# EAGLE design 2-psg-plain (EAGLE 6.6.0)
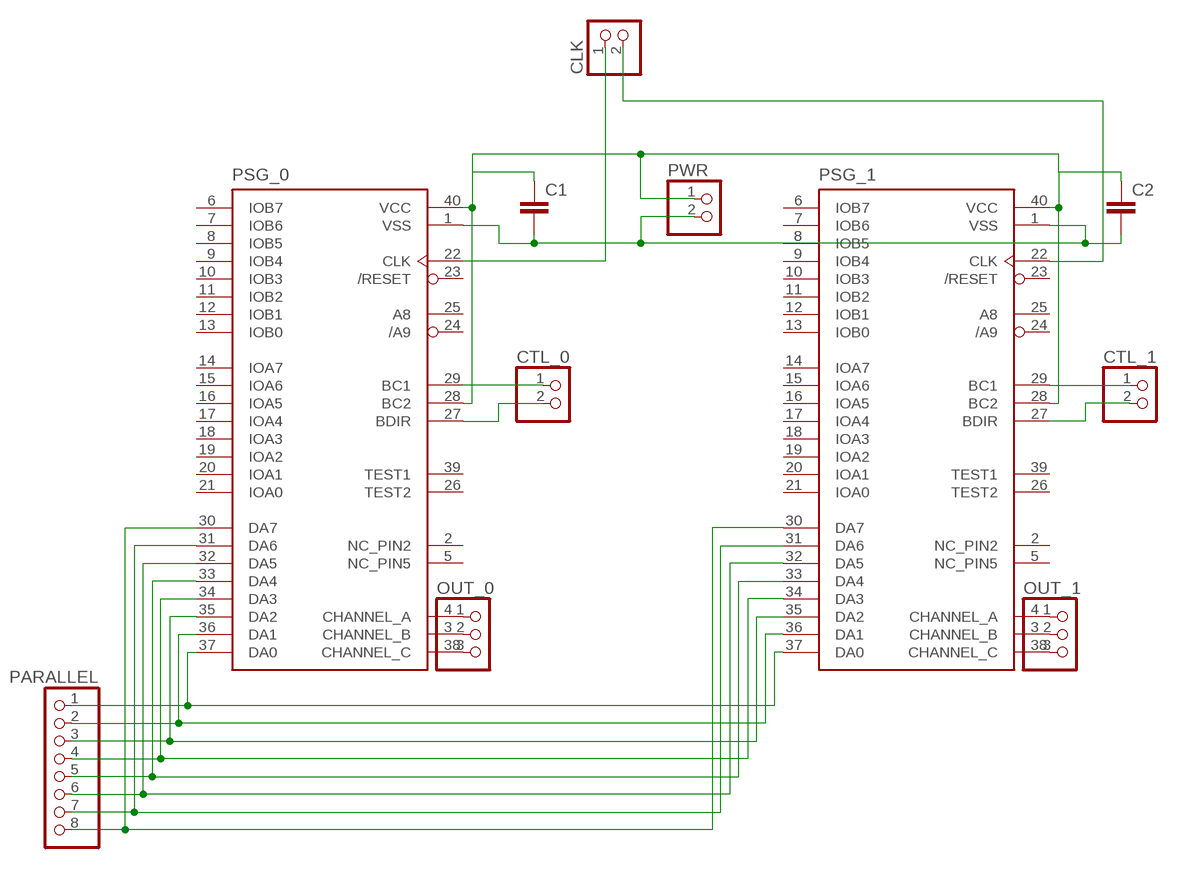
[diagram p0: schematic, sheet 1]

## Parts
C1  050X030_0251  [050X030_025]
C2  050X030_0251  [050X030_025]
CLK  PINHD-1X2  [1X02]
CTL_0  PINHD-1X2  [1X02]
CTL_1  PINHD-1X2  [1X02]
OUT_0  PINHD-1X3  [1X03]
OUT_1  PINHD-1X3  [1X03]
PARALLEL  PINHD-1X8  [1X08]
PSG_0  AY-3-8910  [DIL40]
PSG_1  AY-3-8910  [DIL40]
PWR  PINHD-1X2  [1X02]

## Nets
GND: C1.2 C2.2 PSG_0.1(VSS) PSG_1.1(VSS) PWR.2
N$1: CTL_0.2 PSG_0.27(BDIR)
N$2: CTL_0.1 PSG_0.29(BC1)
N$3: OUT_0.1 PSG_0.4(CHANNEL_A)
N$4: OUT_0.2 PSG_0.3(CHANNEL_B)
N$5: OUT_0.3 PSG_0.38(CHANNEL_C)
N$6: CTL_1.2 PSG_1.27(BDIR)
N$7: PARALLEL.1 PSG_0.37(DA0) PSG_1.37(DA0)
N$8: OUT_1.1 PSG_1.4(CHANNEL_A)
N$9: PARALLEL.2 PSG_0.36(DA1) PSG_1.36(DA1)
N$10: OUT_1.2 PSG_1.3(CHANNEL_B)
N$11: OUT_1.3 PSG_1.38(CHANNEL_C)
N$12: CLK.1 PSG_0.22(CLK)
N$13: CTL_1.1 PSG_1.29(BC1)
N$14: CLK.2 PSG_1.22(CLK)
N$15: PARALLEL.3 PSG_0.35(DA2) PSG_1.35(DA2)
N$16: PARALLEL.4 PSG_0.34(DA3) PSG_1.34(DA3)
N$17: PARALLEL.5 PSG_0.33(DA4) PSG_1.33(DA4)
N$18: PARALLEL.6 PSG_0.32(DA5) PSG_1.32(DA5)
N$19: PARALLEL.7 PSG_0.31(DA6) PSG_1.31(DA6)
N$20: PARALLEL.8 PSG_0.30(DA7) PSG_1.30(DA7)
VCC: C1.1 C2.1 PSG_0.28(BC2) PSG_0.40(VCC) PSG_1.28(BC2) PSG_1.40(VCC) PWR.1
Unconnected: PSG_0.2(NC_PIN2) PSG_0.5(NC_PIN5) PSG_0.6(IOB7) PSG_0.7(IOB6) PSG_0.8(IOB5) PSG_0.9(IOB4) PSG_0.10(IOB3) PSG_0.11(IOB2) PSG_0.12(IOB1) PSG_0.13(IOB0) PSG_0.14(IOA7) PSG_0.15(IOA6) PSG_0.16(IOA5) PSG_0.17(IOA4) PSG_0.18(IOA3) PSG_0.19(IOA2) PSG_0.20(IOA1) PSG_0.21(IOA0) PSG_0.23(/RESET) PSG_0.24(/A9) PSG_0.25(A8) PSG_0.26(TEST2) PSG_0.39(TEST1) PSG_1.2(NC_PIN2) PSG_1.5(NC_PIN5) PSG_1.6(IOB7) PSG_1.7(IOB6) PSG_1.8(IOB5) PSG_1.9(IOB4) PSG_1.10(IOB3) PSG_1.11(IOB2) PSG_1.12(IOB1) PSG_1.13(IOB0) PSG_1.14(IOA7) PSG_1.15(IOA6) PSG_1.16(IOA5) PSG_1.17(IOA4) PSG_1.18(IOA3) PSG_1.19(IOA2) PSG_1.20(IOA1) PSG_1.21(IOA0) PSG_1.23(/RESET) PSG_1.24(/A9) PSG_1.25(A8) PSG_1.26(TEST2) PSG_1.39(TEST1)

## Library data of the parts
C1 C2 = gm-caps-ceramic:050X030_025: 47 - 120pF Xicon Ceramic Disc 2.5mm lead spacing
CLK CTL_0 CTL_1 PWR = pinhead:PINHD-1X2: PIN HEADER
OUT_0 OUT_1 = pinhead:PINHD-1X3: PIN HEADER
PARALLEL = pinhead:PINHD-1X8: PIN HEADER
PSG_0 PSG_1 = 8Bit_Parts:AY-3-8910

## Board
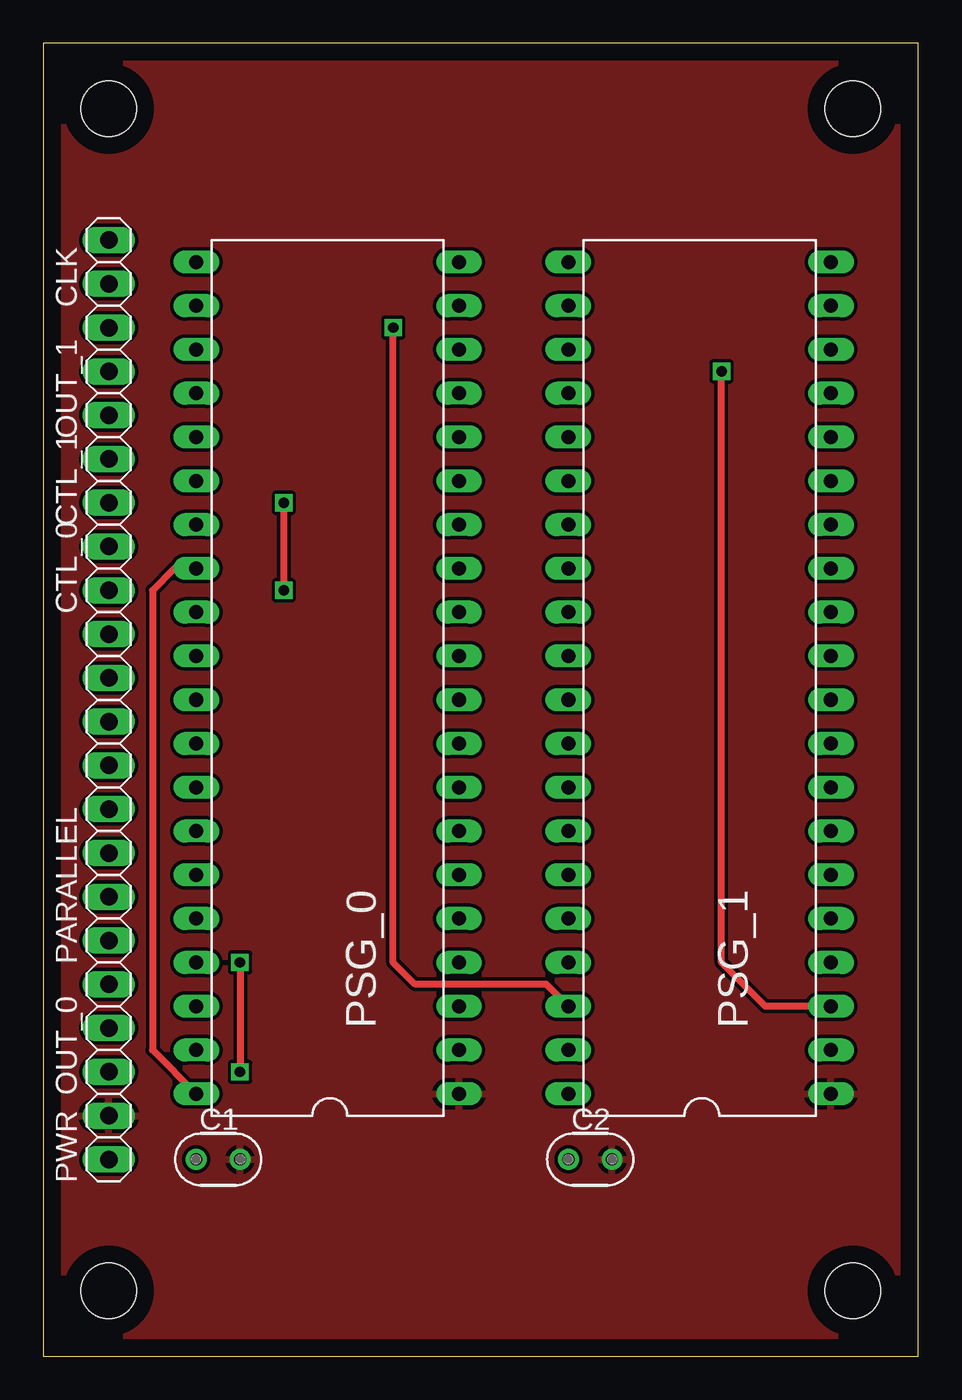
[diagram p1: board, top side]
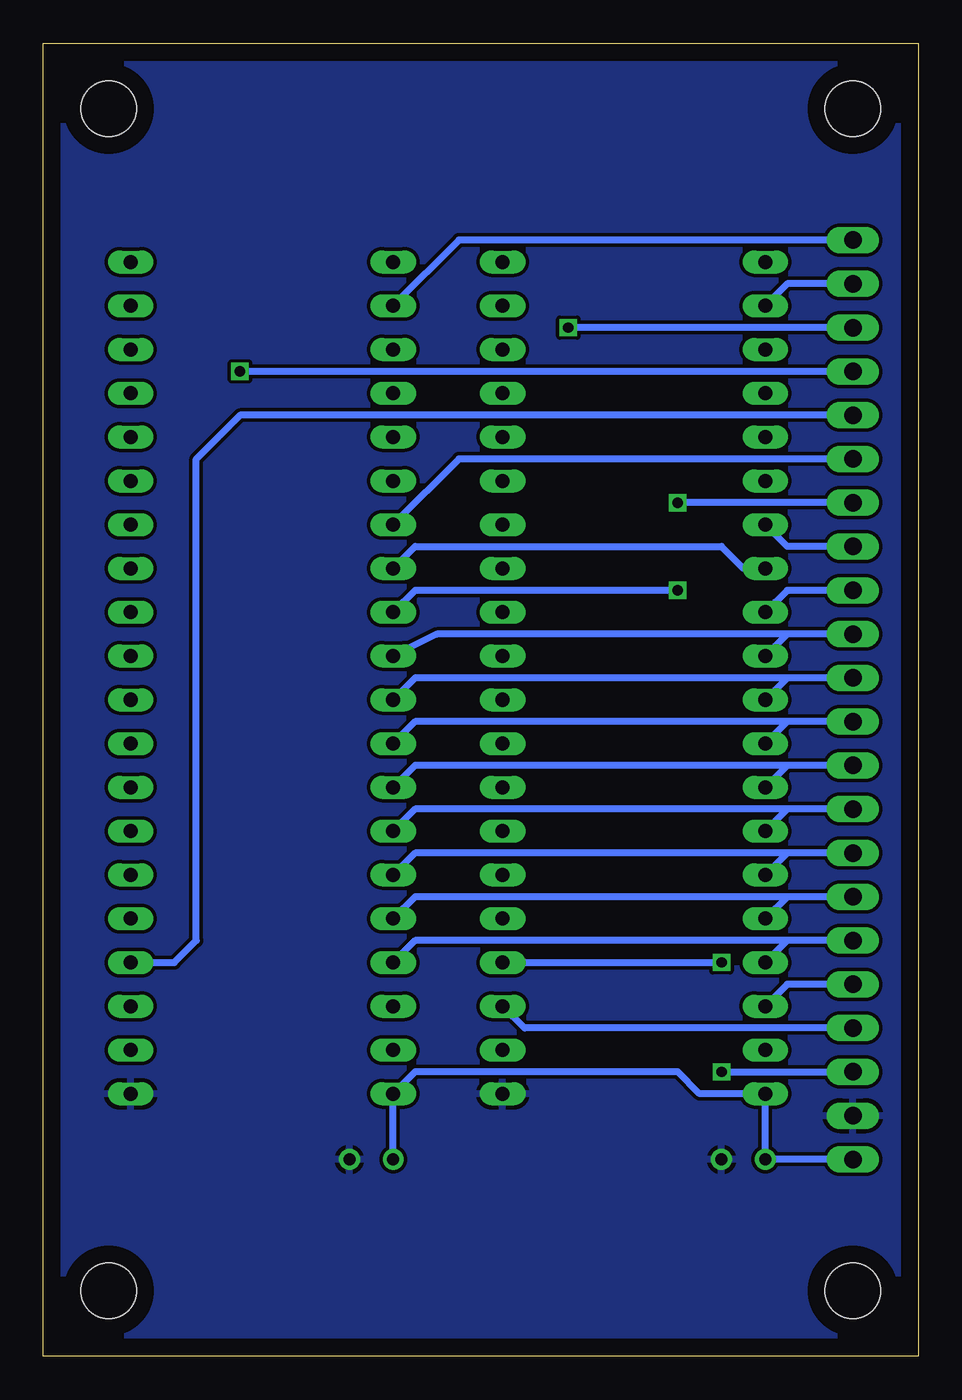
[diagram p2: board, bottom side, seen from below]

Size 50.8 x 76.2 mm. Coordinates in mm from the lower left corner, seen from the top.
Outline: 0,0 50.8,0 50.8,76.2 0,76.2 0,0
Copper layers (1*16): Top 0.035mm / dielectric 1.5mm / Bottom 0.035mm
Design rules "default": minimum track width 10mil, minimum drill 24mil, track to track 8mil, track to pad 8mil, pad to pad 8mil, via to via 8mil, smd to smd 8mil, copper to edge 40mil, drill to drill 8mil, minimum pad ring 10mil, minimum via ring 8mil, stop-mask expansion 4mil, vias tented up to drill 0mil, thermal gap 10mil
Holes 3.2 mm at 3.81,3.81 3.81,72.39 46.99,72.39 46.99,3.81

### Footprints (pad centres in the part's own frame; a part is rotated, then mirrored left to right if it is on the bottom)
050X030_025 = drill 0.7: 1 -1.27,0; 2 1.27,0
1X02 = drill 1.016 long: 1 -1.27,0; 2 1.27,0
1X03 = drill 1.016 long: 1 -2.54,0; 2 0,0; 3 2.54,0
1X08 = drill 1.016 long: 1 -8.89,0; 2 -6.35,0; 3 -3.81,0; 4 -1.27,0; 5 1.27,0; 6 3.81,0; 7 6.35,0; 8 8.89,0
DIL40 = drill 0.813 long: 1 -24.13,-7.62; 2 -21.59,-7.62; 3 -19.05,-7.62; 4 -16.51,-7.62; 5 -13.97,-7.62; 6 -11.43,-7.62; 7 -8.89,-7.62; 8 -6.35,-7.62; 9 -3.81,-7.62; 10 -1.27,-7.62; 11 1.27,-7.62; 12 3.81,-7.62; 13 6.35,-7.62; 14 8.89,-7.62; 15 11.43,-7.62; 16 13.97,-7.62; 17 16.51,-7.62; 18 19.05,-7.62; 19 21.59,-7.62; 20 24.13,-7.62; 21 24.13,7.62; 22 21.59,7.62; 23 19.05,7.62; 24 16.51,7.62; 25 13.97,7.62; 26 11.43,7.62; 27 8.89,7.62; 28 6.35,7.62; 29 3.81,7.62; 30 1.27,7.62; 31 -1.27,7.62; 32 -3.81,7.62; 33 -6.35,7.62; 34 -8.89,7.62; 35 -11.43,7.62; 36 -13.97,7.62; 37 -16.51,7.62; 38 -19.05,7.62; 39 -21.59,7.62; 40 -24.13,7.62

### Placement (x,y rotation side)
C1  10.16,11.43 0 top
C2  31.75,11.43 0 top
CLK  3.81,63.5 90 top
CTL_0  3.81,45.72 90 top
CTL_1  3.81,50.8 90 top
OUT_0  3.81,19.05 90 top
OUT_1  3.81,57.15 90 top
PARALLEL  3.81,33.02 90 top
PSG_0  16.51,39.37 90 top
PSG_1  38.1,39.37 90 top
PWR  3.81,12.7 90 top

### Tracks (layer width: path | path; a pad name or v marks a point on that pad's centre or on a via)
GND
  pour Top: 0,0 0,76.2 50.8,76.2 50.8,0
  pour Bottom: 0,0 0,76.2 50.8,76.2 50.8,0
N$1
  Bottom 0.406: CTL_0.2 7.62,46.99 PSG_0.27
N$2
  Bottom 0.406: CTL_0.1 7.62,44.45 PSG_0.29
N$3  (via drill 0.6)
  Top 0.406: v11.43,22.86 v11.43,16.51
  Bottom 0.406: PSG_0.4 v11.43,22.86 | v11.43,16.51 OUT_0.1
N$4
  Bottom 0.406: OUT_0.2 22.86,19.05 PSG_0.3
N$5
  Bottom 0.406: OUT_0.3 7.62,21.59 PSG_0.38
N$6
  Bottom 0.406: CTL_1.2 26.67,52.07 PSG_1.27
N$7
  Bottom 0.406: PARALLEL.1 7.62,24.13 | 7.62,24.13 PSG_0.37 | 7.62,24.13 29.21,24.13 PSG_1.37
N$8
  Bottom 0.406: OUT_1.1 39.37,54.61 41.91,52.07 41.91,24.13 43.18,22.86 PSG_1.4
N$9
  Bottom 0.406: PARALLEL.2 7.62,26.67 | 7.62,26.67 PSG_0.36 | 7.62,26.67 29.21,26.67 PSG_1.36
N$10  (via drill 0.6)
  Top 0.406: PSG_1.3 41.91,20.32 39.37,22.86 v39.37,57.15
  Bottom 0.406: OUT_1.2 v39.37,57.15
N$11  (via drill 0.6)
  Top 0.406: v20.32,59.69 20.32,22.86 21.59,21.59 29.21,21.59 PSG_1.38
  Bottom 0.406: OUT_1.3 v20.32,59.69
N$12
  Bottom 0.406: CLK.1 7.62,62.23 PSG_0.22
N$13  (via drill 0.6)
  Top 0.406: v13.97,49.53 v13.97,44.45
  Bottom 0.406: CTL_1.1 v13.97,49.53 | v13.97,44.45 29.21,44.45 PSG_1.29
N$14
  Bottom 0.406: CLK.2 26.67,64.77 PSG_1.22
N$15
  Bottom 0.406: PARALLEL.3 7.62,29.21 | 7.62,29.21 PSG_0.35 | 7.62,29.21 29.21,29.21 PSG_1.35
N$16
  Bottom 0.406: PARALLEL.4 7.62,31.75 | 7.62,31.75 PSG_0.34 | 7.62,31.75 29.21,31.75 PSG_1.34
N$17
  Bottom 0.406: PARALLEL.5 7.62,34.29 | 7.62,34.29 PSG_0.33 | 7.62,34.29 29.21,34.29 PSG_1.33
N$18
  Bottom 0.406: PARALLEL.6 7.62,36.83 | 7.62,36.83 PSG_0.32 | 7.62,36.83 29.21,36.83 PSG_1.32
N$19
  Bottom 0.406: PARALLEL.7 7.62,39.37 | PSG_0.31 7.62,39.37 | 7.62,39.37 29.21,39.37 PSG_1.31
N$20
  Bottom 0.406: PARALLEL.8 7.62,41.91 | 7.62,41.91 27.94,41.91 PSG_1.30 | PSG_0.30 7.62,41.91
VCC  (via drill 0.6)
  Top 0.406: PSG_0.28 7.62,45.72 6.35,44.45 6.35,17.78 PSG_0.40
  Bottom 0.406: PWR.1 C1.1 PSG_0.40 12.7,15.24 13.97,16.51 29.21,16.51 PSG_1.40 C2.1 | PSG_1.28 29.21,46.99 11.43,46.99 10.16,45.72 PSG_0.28
  other vias: 8.89,45.72